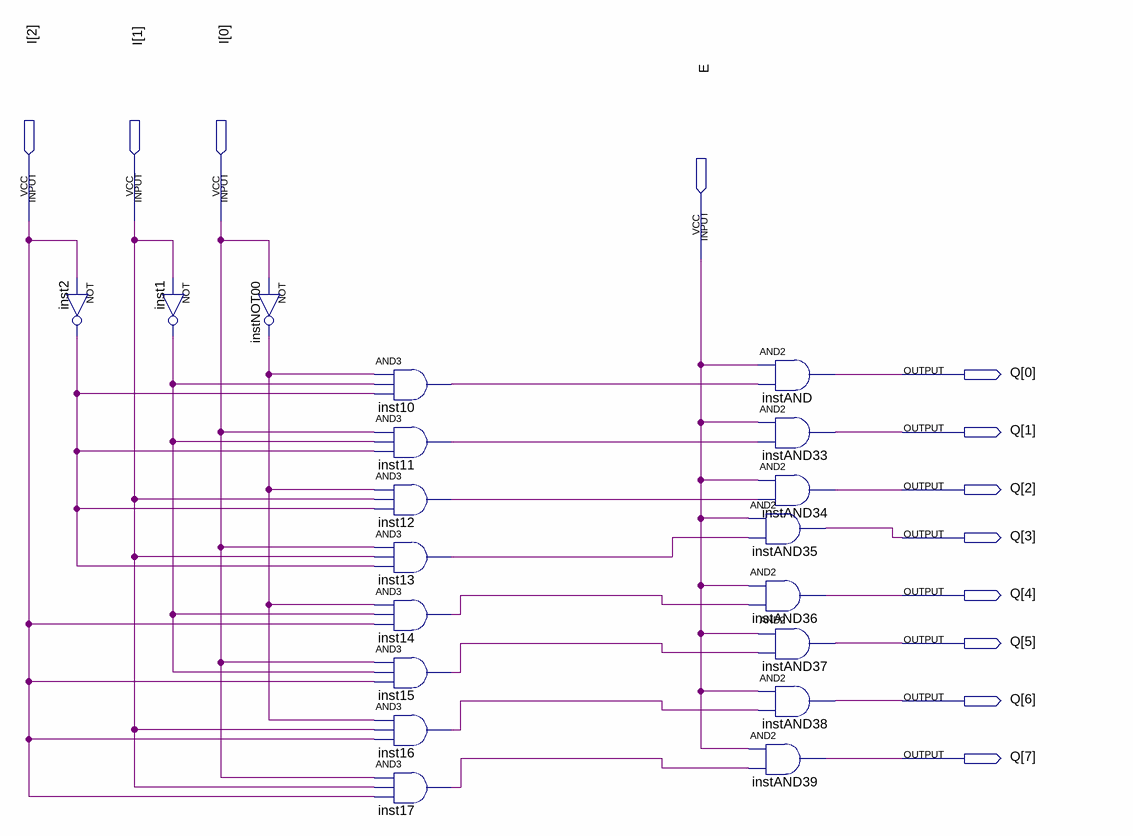
[diagram p0: schematic sheet]
// Quartus schematic Decode.bdf as structural Verilog: 19 symbols, 12 pins
module Decode (
  input  [2:0] I,
  input  E,
  output [7:0] Q
);

  wire inst1_out, inst2_out, inst10_out, inst11_out, inst12_out, inst13_out, inst14_out, inst15_out,
       inst16_out, inst17_out, instNOT00_out;

  not inst2 (inst2_out, I[2]);
  not inst1 (inst1_out, I[1]);
  not instNOT00 (instNOT00_out, I[0]);
  and inst10 (inst10_out, instNOT00_out, inst1_out, inst2_out);
  and inst11 (inst11_out, I[0], inst1_out, inst2_out);
  and inst12 (inst12_out, instNOT00_out, I[1], inst2_out);
  and inst13 (inst13_out, I[0], I[1], inst2_out);
  and inst14 (inst14_out, instNOT00_out, inst1_out, I[2]);
  and inst15 (inst15_out, I[0], inst1_out, I[2]);
  and inst16 (inst16_out, instNOT00_out, I[1], I[2]);
  and inst17 (inst17_out, I[0], I[1], I[2]);
  and instAND (Q[0], E, inst10_out);
  and instAND33 (Q[1], E, inst11_out);
  and instAND34 (Q[2], E, inst12_out);
  and instAND35 (Q[3], E, inst13_out);
  and instAND36 (Q[4], E, inst14_out);
  and instAND37 (Q[5], E, inst15_out);
  and instAND38 (Q[6], E, inst16_out);
  and instAND39 (Q[7], E, inst17_out);
endmodule
